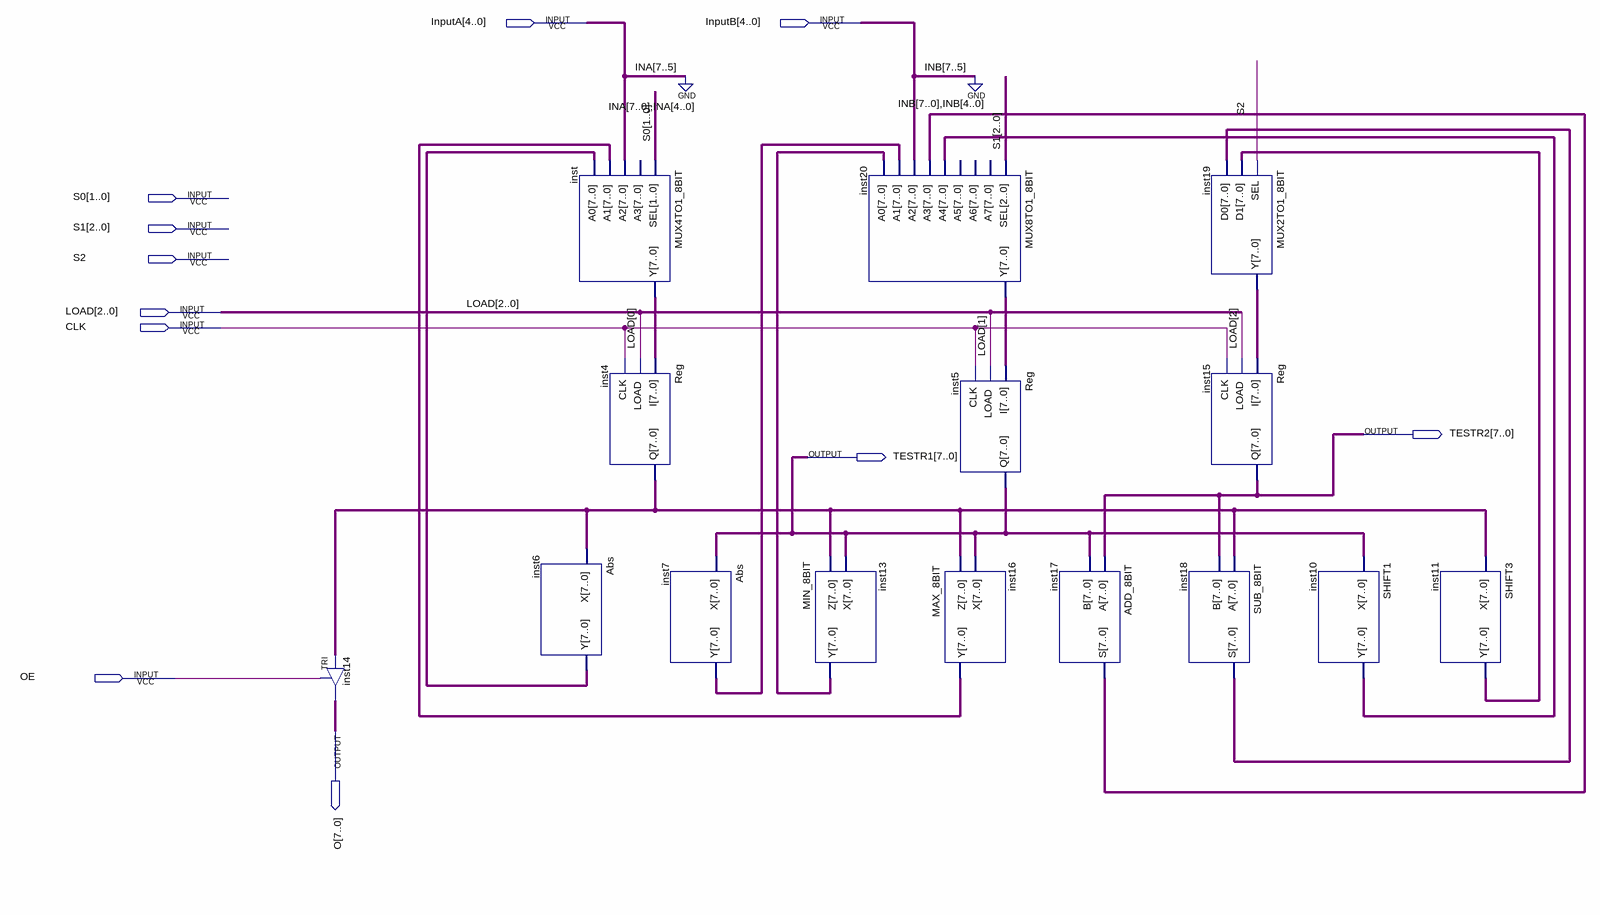
[diagram p0: schematic sheet]
// Quartus schematic test.bdf as structural Verilog: 15 symbols, 11 pins
module test (
  input  [4:0] InputA,
  input  [4:0] InputB,
  input  [1:0] S0,
  input  [2:0] S1,
  input  S2,
  input  [2:0] LOAD,
  input  CLK,
  input  OE,
  output [7:0] TESTR2,
  output [7:0] TESTR1,
  output [7:0] O
);

  wire [4:0] INA, INB;
  wire [7:0] inst4_q, inst6_y, inst7_y, inst10_y, inst11_y, inst13_y, inst16_y, inst17_s, inst18_s, inst19_y,
       inst20_y, inst_y;

  TRI inst14[7:0] (.IN(inst4_q), .OE(OE), .OUT(O));
  MUX4TO1_8BIT inst (.SEL(S0), .A2({3'b000, INA, INA}), .A1(inst16_y), .A0(inst6_y), .Y(inst_y));  // open: A3
  Abs inst6 (.X(inst4_q), .Y(inst6_y));
  Reg inst4 (.I(inst_y), .LOAD(LOAD[0]), .CLK(CLK), .Q(inst4_q));
  Abs inst7 (.X(TESTR1), .Y(inst7_y));
  MIN_8BIT inst13 (.Z(inst4_q), .X(TESTR1), .Y(inst13_y));
  MUX8TO1_8BIT inst20 (
    .SEL(S1), .A4(inst10_y), .A3(inst17_s), .A2({3'b000, INB, INB}), .A1(inst7_y), .A0(inst13_y), .Y(inst20_y));  // open: A7, A6, A5
  MAX_8BIT inst16 (.Z(inst4_q), .X(TESTR1), .Y(inst16_y));
  Reg inst5 (.I(inst20_y), .LOAD(LOAD[1]), .CLK(CLK), .Q(TESTR1));
  ADD_8BIT inst17 (.A(TESTR2), .B(TESTR1), .S(inst17_s));
  SUB_8BIT inst18 (.A(inst4_q), .B(TESTR2), .S(inst18_s));
  MUX2TO1_8BIT inst19 (.SEL(S2), .D1(inst11_y), .D0(inst18_s), .Y(inst19_y));
  Reg inst15 (.I(inst19_y), .LOAD(LOAD[2]), .CLK(CLK), .Q(TESTR2));
  SHIFT1 inst10 (.X(TESTR1), .Y(inst10_y));
  SHIFT3 inst11 (.X(inst4_q), .Y(inst11_y));
endmodule
